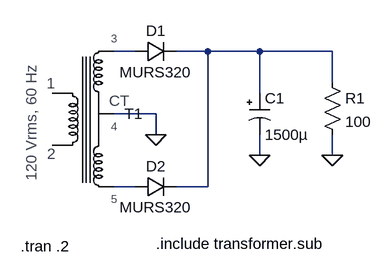
[diagram p0: schematic LinePS.Sub.asc]
LinePS.Sub.asc, the LTspice schematic file:
Version 4
SHEET 1 880 680
WIRE 176 48 144 48
WIRE 288 48 240 48
WIRE 368 48 288 48
WIRE 480 48 368 48
WIRE 480 96 480 48
WIRE 368 112 368 48
WIRE 208 144 144 144
WIRE 208 176 208 144
WIRE 368 208 368 176
WIRE 480 208 480 176
WIRE 176 256 144 256
WIRE 288 256 288 48
WIRE 288 256 240 256
FLAG 208 176 0
FLAG 368 208 0
FLAG 480 208 0
SYMBOL diode 176 64 R270
WINDOW 0 32 32 VTop 0
WINDOW 3 0 32 VBottom 0
SYMATTR InstName D1
SYMATTR Value MURS320
SYMBOL diode 176 272 R270
WINDOW 0 32 32 VTop 0
WINDOW 3 0 32 VBottom 0
SYMATTR InstName D2
SYMATTR Value MURS320
SYMBOL polcap 352 112 R0
WINDOW 3 24 64 Left 0
SYMATTR Value 1500µ
SYMATTR InstName C1
SYMATTR Description Capacitor
SYMATTR Type cap
SYMATTR SpiceLine V=35 Irms=2.36 Rser=0.024 Lser=0 mfg="Nichicon" pn="UPL1V152MRH" type="Al electrolytic"
SYMBOL res 464 80 R0
SYMATTR InstName R1
SYMATTR Value 100
SYMBOL transformer 160 144 R0
WINDOW 0 0 0 Left 0
SYMATTR InstName T1
SYMATTR Prefix x
SYMATTR SpiceModel transformer.sub
TEXT 208 344 Left 0 !.include transformer.sub
TEXT 0 348 Left 0 !.tran .2

The netlist it stands for:
* LinePS.Sub.asc
D1 N001 N002 MURS320
D2 N003 N002 MURS320
C1 N002 0 1500µ V=35 Irms=2.36 Rser=0.024 Lser=0 mfg="Nichicon" pn="UPL1V152MRH" type="Al electrolytic"
R1 N002 0 100
XT1 N001 0 N003 transformer params: ACV=120  RATIO_1={1/6}  RATIO_2={1/6}  ; pins 3 4 5
.model D D
.lib standard.dio
.include transformer.sub
.tran .2
.backanno
.end